# Altium schematic sheet TDR_Schematic_PB.SchDoc: Bardzo zaawansowany, madrze brzmiacy temat pracy dyplomowej. Jest tez bardzo dlugi.
size A4 portrait; Author: Student X.; Revision: 1.1; SheetNumber: 2; SheetTotal: 3; Comments: param:Comments; Wersja: 1.0; CustomerInfo: CustInfo; CustomerAddress: CustAddr; CopyrightBy: Maciejo; CopyrightDate: 2016; TopSheet: Nazwa lub sciezka do pliku z glownym schematem projektu; CurrentSheet: Current sheet; NrIndeksu: 123456; Promotor: Prof. dr. hab. inż. arch. lek. artysta i tynkarz; ProjectName: Project Name
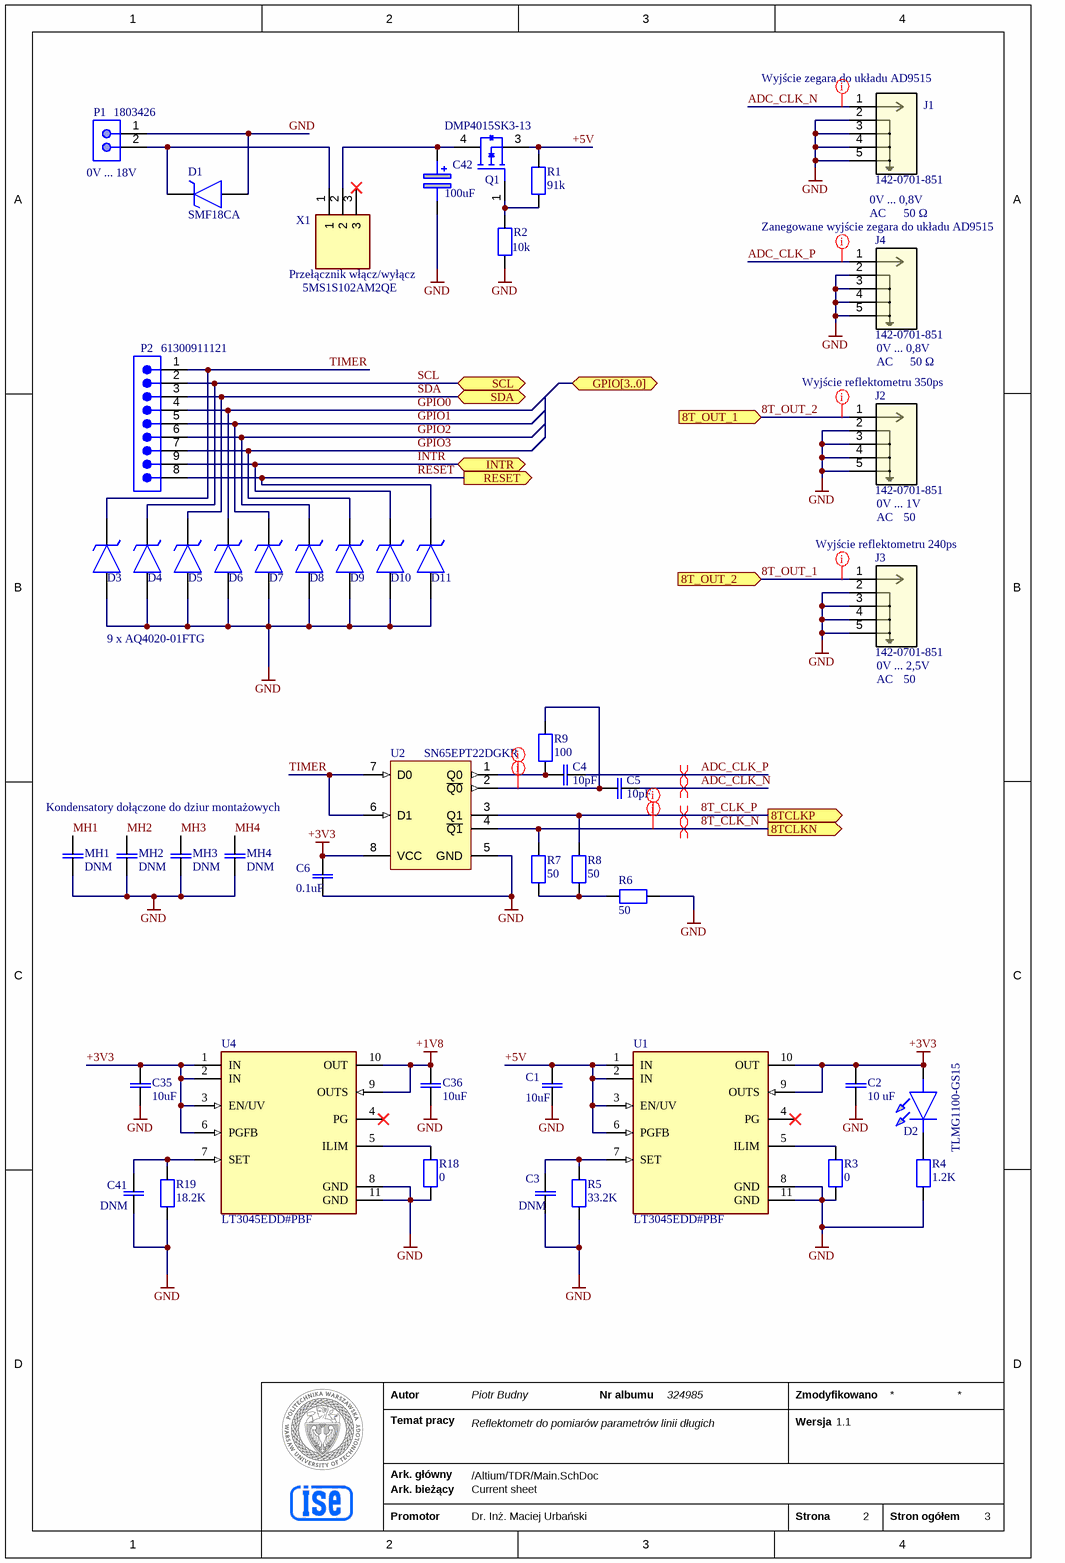
[diagram p0: TDR_Schematic_PB.SchDoc]

## Parts
C1  10uF  [CAP_C0805X-HAC-DR_KEM]
C2  10 uF  [CAP_C0805X-HAC-DR_KEM]
C3  DNM  [CAP_C0805X-HAC-DR_KEM]
C4  10pF  [CAPC0402]
C5  10pF  [CAPC0402]
C6  0.1uF  [CAPC0603]
C35  10uF  [CAP_C0805X-HAC-DR_KEM]
C36  10uF  [CAP_C0805X-HAC-DR_KEM]
C41  DNM  [CAP_C0805X-HAC-DR_KEM]
C42  100uF  [CAPPRD200W55D500H1250 - duplicate]
D1  SMF18CA  [SODFL3618X110N]
D2  TLMG1100-GS15  [TLMG1100GS15]
D3  AQ4020-01FTG  [SOD2613X114N]  (value not drawn)
D4  AQ4020-01FTG  [SOD2613X114N]  (value not drawn)
D5  AQ4020-01FTG  [SOD2613X114N]  (value not drawn)
D6  AQ4020-01FTG  [SOD2613X114N]  (value not drawn)
D7  AQ4020-01FTG  [SOD2613X114N]  (value not drawn)
D8  AQ4020-01FTG  [SOD2613X114N]  (value not drawn)
D9  AQ4020-01FTG  [SOD2613X114N]  (value not drawn)
D10  AQ4020-01FTG  [SOD2613X114N]  (value not drawn)
D11  AQ4020-01FTG  [SOD2613X114N]  (value not drawn)
J1  142-0701-851  [CONN_142-0701-851_CIN]
J2  142-0701-851  [CONN_142-0701-851_CIN]
J3  142-0701-851  [CONN_142-0701-851_CIN]
J4  142-0701-851  [CONN_142-0701-851_CIN]
MH1  DNM  [CAPC0603]
MH2  DNM  [CAPC0603]
MH3  DNM  [CAPC0603]
MH4  DNM  [CAPC0603]
P1  1803426  [PHOE-1803426_V]
P2  61300911121  [61300911121]
Q1  DMP4015SK3-13  [DMP4015SK3-13]
R1  91k  [RES0805]
R2  10k  [RES0805]
R3  0  [RES0805]
R4  1.2K  [RESC0603]
R5  33.2K  [RES0805]
R6  50  [RESC0603]
R7  50  [RESC0603]
R8  50  [RESC0603]
R9  100  [RESC0603]
R18  0  [RES0805]
R19  18.2K  [RES0805]
U1  LT3045EDD#PBF  [FP-LT3045EDD#PBF-MFG]
U2  SN65EPT22DGKR  [DGK0008A_M]
U4  LT3045EDD#PBF  [FP-LT3045EDD#PBF-MFG]
X1  5MS1S102AM2QE  [5MS1S102AM2QE]  (value not drawn)

## Ports
8T_OUT_1 (in, see Main[1B], 8T49N241-999NLGI[4B]), 8T_OUT_2 (in, see Main[1B], 8T49N241-999NLGI[4C]), 8TCLKN (out, see Main[2B], 8T49N241-999NLGI[2B]), 8TCLKP (out, see Main[2B], 8T49N241-999NLGI[2B]), GPIO[3..0] (bidir, see Main[2A], 8T49N241-999NLGI[1C]), INTR (bidir, see Main[2A], 8T49N241-999NLGI[1C]), RESET (out, see Main[2A], 8T49N241-999NLGI[1C]), SCL (bidir, see Main[2A], 8T49N241-999NLGI[1B]), SDA (bidir, see Main[2A], 8T49N241-999NLGI[1B])

## Nets
+1V8: C36.2 U4.9(OUTS) U4.10(OUT)
+3V3: C2.2 C6.2 C35.2 D2.2(A) U1.9(OUTS) U1.10(OUT) U2.8(VCC) U4.1(IN) U4.2(IN) U4.3(EN/UV) U4.6(PGFB)
GND: C1.1 C2.1 C3.1 C6.1 C35.1 C36.1 C41.1 C42.2(-) D1.2(A) D3.2(A) D4.2(A) D5.2(A) D6.2(A) D7.2(A) D8.2(A) D9.2(A) D10.2(A) D11.2(A) J1.2 J1.3 J1.4 J1.5 J2.2 J2.3 J2.4 J2.5 J3.2 J3.3 J3.4 J3.5 J4.2 J4.3 J4.4 J4.5 MH1.1 MH2.1 MH3.1 MH4.1 P1.1 R2.1 R3.1 R4.1 R5.1 R6.1 R18.1 R19.1 U1.8(GND) U1.11(GND) U2.5(GND) U4.8(GND) U4.11(GND)
8T_CLK_N: R7.2 U2.4(~{Q1}) ; port 8TCLKN
8T_CLK_P: R8.2 U2.3(Q1) ; port 8TCLKP
8T_OUT_1: J3.1 ; port 8T_OUT_2
8T_OUT_2: J2.1 ; port 8T_OUT_1
+5V: C1.2 Q1.3 R1.2 U1.1(IN) U1.2(IN) U1.3(EN/UV) U1.6(PGFB)
ADC_CLK_N: C5.2 J1.1
ADC_CLK_P: C4.2 J4.1
GPIO0: D6.1(K) P2.4
GPIO1: D7.1(K) P2.5
GPIO2: D8.1(K) P2.6
GPIO3: D9.1(K) P2.7
INTR: D10.1(K) P2.9 ; port INTR
MH1: MH1.2
MH2: MH2.2
MH3: MH3.2
MH4: MH4.2
RESET: D11.1(K) P2.8 ; port RESET
SCL: D4.1(K) P2.2 ; port SCL
SDA: D5.1(K) P2.3 ; port SDA
TIMER: D3.1(K) P2.1 U2.6(D1) U2.7(D0)
NetC3_2: C3.2 R5.2 U1.7(SET)
NetC4_1: C4.1 R9.1 U2.1(Q0)
NetC5_1: C5.1 R9.2 U2.2(~{Q0})
NetC41_2: C41.2 R19.2 U4.7(SET)
NetC42_1: C42.1(+) Q1.4 X1.2
NetD1_1: D1.1(K) P1.2 X1.1
NetD2_1: D2.1(K) R4.2
NetQ1_1: Q1.1 R1.1 R2.2
NetR3_2: R3.2 U1.5(ILIM)
NetR6_2: R6.2 R7.1 R8.1
NetR18_2: R18.2 U4.5(ILIM)

Not connected (* = marked no-connect by the designer): U1 4(PG)*; U4 4(PG)*; X1 3*

## Layout directives
differential pair: 8T_CLK_N, 8T_CLK_P, ADC_CLK_N, ADC_CLK_P
net class Signal: 8T_OUT_1, 8T_OUT_2
net class Diff_Signal: 8T_CLK_N, 8T_CLK_P, ADC_CLK_N, ADC_CLK_P, NetC4_1, NetC5_1

## Notes on the sheet
- (near J1) Wyjście zegara do układu AD9515
- (near P1) 0V ... 18V
- (near J4) Zanegowane wyjście zegara do układu AD9515
- 0V ... 0,8V
- AC
- 50 Ω
- Przełącznik włącz/wyłącz
- 5MS1S102AM2QE
- (near J4) 0V ... 0,8V
- (near J2) Wyjście reflektometru 350ps
- (near J2) 0V ... 1V
- (near J3) Wyjście reflektometru 240ps
- 50
- 9 x AQ4020-01FTG
- (near J3) 0V ... 2,5V
- (near J3) AC
- (near J3) 50
- Kondensatory dołączone do dziur montażowych
- Autor
- Temat pracy
- Piotr Budny
- Reflektometr do pomiarów parametrów linii długich
- Nr albumu
- 324985
- Zmodyfikowano
- Wersja
- Ark. główny
- Ark. bieżący
- /Altium/TDR/Main.SchDoc
- Promotor
- Dr. Inż. Maciej Urbański
- Strona
- Stron ogółem

## Library data of the parts
C1-C3 C35 C36 C41 = C0805X399C8HAC7800: No Description Available; Manufacturer_Name: Kemet; Copyright: Copyright (C) 2025 Ultra Librarian. All rights reserved.; Manufacturer_Part_Number: C0805X399C8HAC7800
C4 C5 = C0603: No Description Available; Manufacturer_Name: Kemet; Manufacturer_Part_Number: C0805X399C8HAC7800; Copyright: Copyright (C) 2025 Ultra Librarian. All rights reserved.
C6 MH1-MH4 = C0603: CAP SMD 0805; Manufacturer_Name: Kemet; Manufacturer_Part_Number: C0805X399C8HAC7800; Copyright: Copyright (C) 2025 Ultra Librarian. All rights reserved.
C42 = 100uF electrolitic
D1 = SMF5.0A-T13: TVS Diode (Uni-directional); Manufacturer_Name: LITTELFUSE; Datasheet Link: https://www.littelfuse.com/~/media/electronics/datasheets/tvs_diodes/littelfuse_tvs_diode_smf_datasheet.pdf.pdf; Height: 1.1mm; Manufacturer_Part_Number: SMF5.0A-T13; Mouser Part Number: 576-SMF5.0A-T13; Mouser Price/Stock: https://www.mouser.co.uk/ProductDetail/Littelfuse/SMF5.0A-T13?qs=aGgfWYEhH7lEohru0mAWAg%3D%3D; Arrow Part Number: SMF5.0A-T13; Arrow Price/Stock: https://www.arrow.com/en/products/smf5.0a-t13/littelfuse?utm_currency=USD&region=nac
D2 = TLMG1100-GS15: Standard LEDs - SMD CHIPLED(SMD 0603-LED) GREEN U.BRIGHT-E4; Manufacturer_Name: Vishay; Geometry.Height: 0.65mm; Mouser Part Number: 78-TLMG1100-GS15; Mouser Price/Stock: https://www.mouser.co.uk/ProductDetail/Vishay-Semiconductors/TLMG1100-GS15?qs=vvQtp7zwQdObPNLeC1kn7g%3D%3D; Manufacturer_Part_Number: TLMG1100-GS15; Datasheet Link: https://www.vishay.com/docs/83173/tlmx1100.pdf
D3-D11 = AQ4020-01FTG: TVS Diode (Uni-directional); Manufacturer_Name: LITTELFUSE; Datasheet Link: https://componentsearchengine.com/Datasheets/2/AQ4020-01FTG.pdf; Height: 1.14mm; Manufacturer_Part_Number: AQ4020-01FTG; Mouser Part Number: 576-AQ4020-01FTG; Mouser Price/Stock: https://www.mouser.co.uk/ProductDetail/Littelfuse/AQ4020-01FTG?qs=YCa%2FAAYMW015W3B84qpvIw%3D%3D; Arrow Part Number: AQ4020-01FTG; Arrow Price/Stock: https://www.arrow.com/en/products/aq4020-01ftg/littelfuse?utm_currency=USD&region=nac
J1-J4 = 142-0701-851: Description; Manufacturer_Name: Cinch Connectivity Solutions; Copyright: Copyright (C) 2025 Ultra Librarian. All rights reserved.; Manufacturer_Part_Number: 142-0701-851; RefDes: RefDes; Type: Type
P1 = CMP-2000-05826-1: Male Header, Pitch 3.81 mm, 1 x 2 Position, Height 9.2 mm, Tail Length 3.4 mm; Manufacturer: Phoenix Contact; Manufacturer URL: http://www.phoenixcontact.com/; Datasheet Version: 02/2015; Mounting Technology: ThroughHole; Package Description: Male Header, Pitch 3.81 mm, 1 x 2 Position, Height 9.2 mm; Datasheet URL: https://www.phoenixcontact.com/online/portal/cn/pxc/product_detail_page/!ut/p/b1/3VfHjrNIGHyWeQDG5HAkm5zjxQIM2AQDNvnp1zNa7WFX889l5YPpA6L1qUtVdFX3d4gPEYCiFAaBJHgID_Etma9lMl67W9J8fcf4iRJ1HIRRHAIZDANpTKVtR3IFAyUOwSEE0ZNTbb2iOquuOqg8OKsEReRD0XpT8cAJtHK1h62gd5Lwwj7fSR7gfNZiWNE2tu2Xg71pvaHw3VHbDIccysUbixteZxggMWJnxWgP9KIolKko13HrKNI0OD69xjcsLwZb9oJmcNi4flh1xw9LW6-eWTQ9nREGMg82nQ7i5d6Jdk07dw7fZbrokLagaoyYggEvB4C7H5W4HERjSAam7I1pSvC1iqzSu8itk8CidtE6n3bP2nD0Pp6iRD-LQiLob5pFzwLixwIWO7iH0PcgleukhedgldkYbrFLA5WSM7ufG5_qGPkUc9vEzZQaS901mlWkPYn5tWxhabkCUfW4SsSIbpPuMIJHpQReslhERyEnqVrZBIU1V5Nilrs5X123FVtC3BVOSLHMP1b6PfXsNSgk1T-F50SEmtzqQUXqhsW5rwQ1o0BXB2gELrcQ4gCUoNAFTBX6N2LEmxJz0Hclhr8rsXf1mPOuHoPf1WPwu3oMflePSW-7Fd81PGj4i1jqc2r6kGnO3K4b7QxsE14hAduG8C7FaT2GvZ7I-s0j05SGAI1kaO9y99Mt55acg9cLDNYaWwQcdDTPAtjrfMY1OBkOcVEr9HZ8tGspIQLbIVDtpjctgzHFMG4BAZsGvQthBBH4WA-nFo17BJ08nhvnnSIvtClxxDZLZLDt43EXgXAD-FUl6xp1LReX8w3Sb-3dEFiLergsTPmiPWlKHKTnUE9MvjMWis8MoKAxhXcLRQoyR1OjaJFnuS2q9AQSlWi71_PQS1I7hwNcTAR9vGjIY_k4yIf4mrafS9Z-gp_9mn329-4; Package Reference: 1803426
P2 = CMP-1502-01080-4: THT Vertical Pin Header WR-PHD, Pitch 2.54 mm, Single Row, 9 pins; Current Rating: 3A; Connector Type: Male Pin; Operating Supply Voltage: 250V; Contact Resistance: 20mΩ; Pitch: 2.54mm; Number of Contacts: 9; Gender: Male; Lead Pitch: 2.54mm; Number of Rows: 1; Mount: Through Hole; Contact Plating: Gold; Color: Black; Number of Pins: 9; Orientation: Vertical; Contact Material: Copper; Packaging: Bulk; Contact Mating Length: 5.9944mm; RoHS: Compliant; Number of Positions: 9; Termination: Solder
R1-R3 R5 R18 R19 = R0805: RES SMD 0805; MP: RT0805FRE075K36L; Package: None; Price: None; Value: *; Availability: Unavailable
R4 R6-R9 = R0603: RES SMD 0603; MP: RT0805FRE075K36L; Package: None; Price: None; Value: *; Availability: Unavailable
U1 U4 = CMP-09138-000240-1: IC REG LINEAR 0V 500MA 10DFN; Min Current Limit: 570mA; Number of Regulators: 1; Dropout Voltage: 260mV; Output Voltage: 15V; RoHS Compliant: Yes; Series: -; Output Current: 500mA; Case/Package: DFN; Max Operating Temperature: 125°C; Min Operating Temperature: -40°C
U2 = CMP-0327-00215-3: 4000 Mbps 3.3 V Dual LVTTL / LVCMOS to Differential LVPECL Buffer, 2 Tx and 2 Rx, -40 to +85 degC, 8-pin VSSOP (DGK), Green (RoHS & no Sb/Br); Manufacturer: Texas Instruments; ICC(Max)(mA): 50; Input Signal: LVTTL, CMOS; No. of Rx: 2; SubFamily: PECL PHY; Signaling Rate(Mbps): 4000; xECL: TRUE; DatasheetVersion: SLLS926A; Output Signal: LVPECL; ComponentLink3Description: URL Link1; PackageVersion: revE, May-2006; ComponentLink1Description: Manufacturer URL; ComponentLink2Description: Datasheet; No. of Tx: 2; ComponentLink1URL: http://www.ti.com/; PackageReference: DGK0008A; Eco-Plan: Green (RoHS & no Sb/Br); Mounting Technology: Surface Mount; PackageDescription: 8-Pin Thin Small Outline Package 3 x 3 mm Body ,0.65 mm Pitch; ComponentLink2URL: http://www.ti.com/general/docs/lit/getliterature.tsp?genericPartNumber=SN65EPT22&fileType=pdf; ComponentLink3URL: SamplesURL:http://www.ti.com/product/sn65ept22#samples; PartNumber: SN65EPT22DGKR
X1 = 5MS1S102AM2QE: Switch: Slide; Positions: 2; SPDT; 2A/250VAC; 5A/28VDC; ON-ON; Manufacturer_Name: LIGHT COUNTRY; Geometry.Height: 12.93mm; TME Electronic Components Part Number: *; TME Electronic Components Price/Stock: *; Manufacturer_Part_Number: 5MS1S102AM2QE; Datasheet Link: https://www.tme.eu/Document/6c0299ce3235dd46f456febe8a77357f/slide_switch_5M.PDF